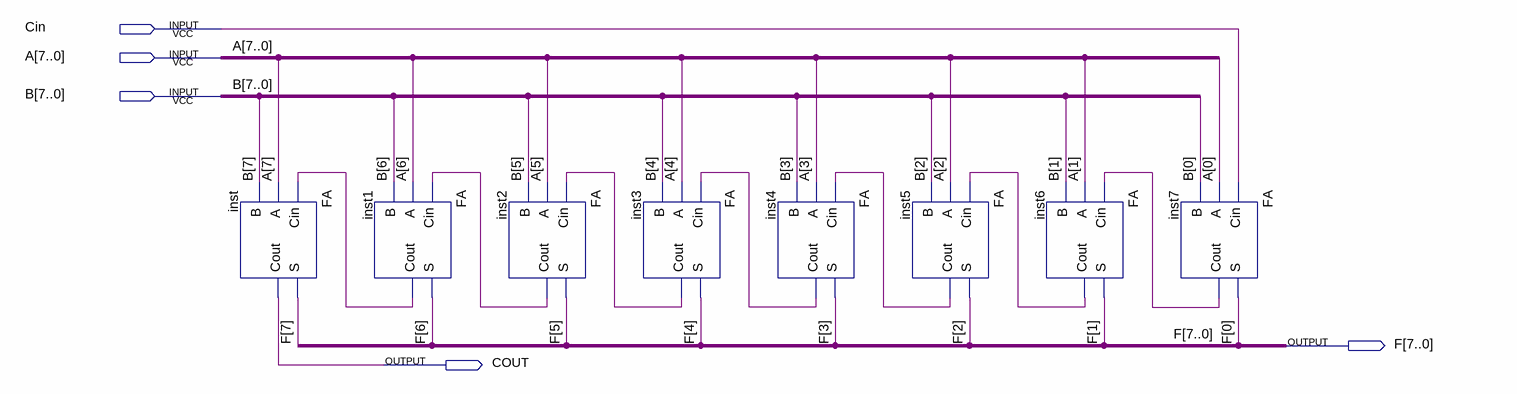
[diagram p0: schematic sheet]
// Quartus schematic ADD.bdf as structural Verilog: 8 symbols, 5 pins
module ADD (
  input  Cin,
  input  [7:0] A,
  input  [7:0] B,
  output [7:0] F,
  output COUT
);

  wire inst1_cout, inst2_cout, inst3_cout, inst4_cout, inst5_cout, inst6_cout, inst7_cout;

  FA inst (.Cin(inst1_cout), .A(A[7]), .B(B[7]), .S(F[7]), .Cout(COUT));
  FA inst1 (.Cin(inst2_cout), .A(A[6]), .B(B[6]), .S(F[6]), .Cout(inst1_cout));
  FA inst2 (.Cin(inst3_cout), .A(A[5]), .B(B[5]), .S(F[5]), .Cout(inst2_cout));
  FA inst3 (.Cin(inst4_cout), .A(A[4]), .B(B[4]), .S(F[4]), .Cout(inst3_cout));
  FA inst4 (.Cin(inst5_cout), .A(A[3]), .B(B[3]), .S(F[3]), .Cout(inst4_cout));
  FA inst5 (.Cin(inst6_cout), .A(A[2]), .B(B[2]), .S(F[2]), .Cout(inst5_cout));
  FA inst6 (.Cin(inst7_cout), .A(A[1]), .B(B[1]), .S(F[1]), .Cout(inst6_cout));
  FA inst7 (.Cin(Cin), .A(A[0]), .B(B[0]), .S(F[0]), .Cout(inst7_cout));
endmodule
